# EAGLE design Butia Eagle v8 (EAGLE 5.09)
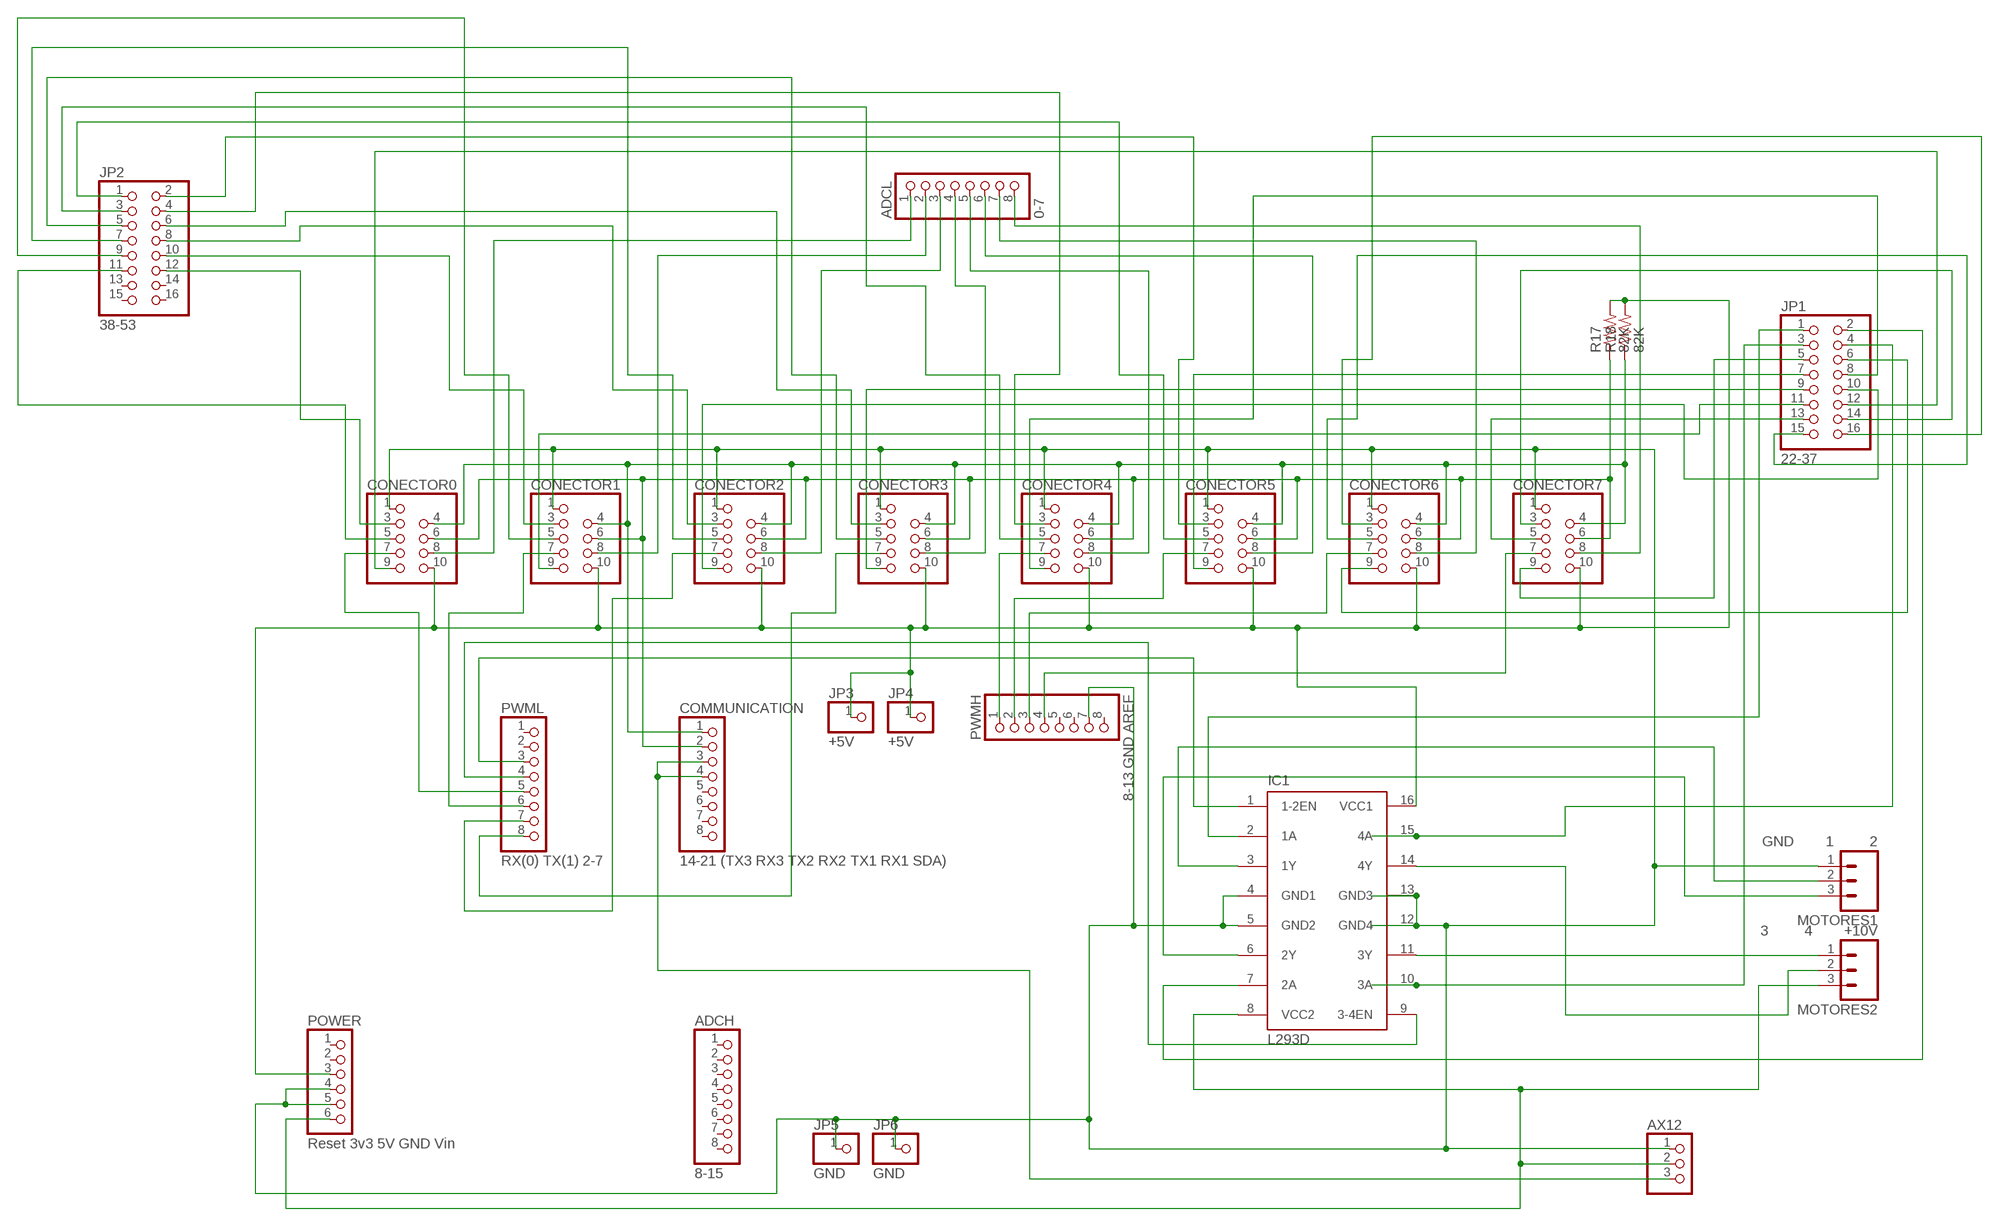
[diagram p0: schematic, sheet 1]

## Parts
ADCH  8-15  PINHD-1X8  [1X08]
ADCL  0-7  PINHD-1X8  [1X08]
AX12  AX12  [AX12]
COMMUNICATION  14-21 (TX3 RX3 TX2 RX2 TX1 RX1 SDA)  PINHD-1X8  [1X08]
CONECTOR0  9PIN  [9PIN]
CONECTOR1  9PIN  [9PIN]
CONECTOR2  9PIN  [9PIN]
CONECTOR3  9PIN  [9PIN]
CONECTOR4  9PIN  [9PIN]
CONECTOR5  9PIN  [9PIN]
CONECTOR6  9PIN  [9PIN]
CONECTOR7  9PIN  [9PIN]
IC1  L293D  [DIL16]
JP1  22-37  PINHD-2X8  [2X08]
JP2  38-53  PINHD-2X8  [2X08]
JP3  +5V  PINHD-1X1  [1X01]
JP4  +5V  PINHD-1X1  [1X01]
JP5  GND  PINHD-1X1  [1X01]
JP6  GND  PINHD-1X1  [1X01]
MOTORES1  GND 1 2  M03SCREW_LOCK  [SCREWTERMINAL-3.5MM-3_LOCK.007S]
MOTORES2  3 4 +10V  M03SCREW_LOCK  [SCREWTERMINAL-3.5MM-3_LOCK.007S]
POWER  Reset 3v3 5V GND Vin  PINHD-1X6  [1X06]
PWMH  8-13 GND AREF  PINHD-1X8  [1X08]
PWML  RX(0) TX(1) 2-7  PINHD-1X8  [1X08]
R17  82K  R-US_0207/7  [0207/7]
R18  82K  R-US_0207/7  [0207/7]

## Nets
+10V [power]: AX12.2 IC1.8(VCC2) MOTORES2.3 POWER.6
MASA [gnd]: AX12.1 CONECTOR0.1 CONECTOR1.1 CONECTOR2.1 CONECTOR3.1 CONECTOR4.1 CONECTOR5.1 CONECTOR6.1 CONECTOR7.1 IC1.4(GND1) IC1.5(GND2) IC1.12(GND4) IC1.13(GND3) JP5.1 JP6.1 MOTORES1.1 POWER.4 POWER.5 PWMH.7
N$1: CONECTOR0.5 JP2.11
N$2: CONECTOR0.3 JP2.12
N$3: CONECTOR1.5 JP2.9
N$4: CONECTOR1.3 JP2.10
N$5: CONECTOR2.5 JP2.7
N$6: CONECTOR2.3 JP2.8
N$8: CONECTOR3.5 JP2.5
N$9: CONECTOR3.3 JP2.6
N$10: CONECTOR4.3 JP2.4
N$11: CONECTOR4.5 JP2.3
N$13: CONECTOR5.3 JP2.2
N$15: CONECTOR6.3 JP1.16
N$16: CONECTOR7.5 JP1.13
N$17: CONECTOR7.3 JP1.14
N$18: ADCL.1 CONECTOR0.8
N$19 [polenta]: IC1.14(4Y) MOTORES2.2
N$20 [polenta]: IC1.11(3Y) MOTORES2.1
N$21 [polenta]: IC1.6(2Y) MOTORES1.3
N$22 [polenta]: IC1.3(1Y) MOTORES1.2
N$23: ADCL.2 CONECTOR1.8
N$24: ADCL.3 CONECTOR2.8
N$25: ADCL.4 CONECTOR3.8
N$26: ADCL.5 CONECTOR4.8
N$27: ADCL.6 CONECTOR5.8
N$28: ADCL.7 CONECTOR6.8
N$29: ADCL.8 CONECTOR7.8
N$30: AX12.3 COMMUNICATION.3 COMMUNICATION.4
N$31: IC1.1(1-2EN) PWML.3
N$32: IC1.9(3-4EN) PWML.4
N$33: CONECTOR0.7 PWML.5
N$34: CONECTOR1.7 PWML.6
N$35: CONECTOR2.7 PWML.7
N$36: CONECTOR3.7 PWML.8
N$37: CONECTOR4.7 PWMH.1
N$38: CONECTOR5.7 PWMH.2
N$39: CONECTOR6.7 PWMH.3
N$40: CONECTOR7.7 PWMH.4
N$41: IC1.2(1A) JP1.1
N$42: IC1.7(2A) JP1.2
N$43: IC1.10(3A) JP1.3
N$44: IC1.15(4A) JP1.4
N$45: CONECTOR7.9 JP1.5
N$46: CONECTOR6.9 JP1.6
N$47: CONECTOR5.9 JP1.7
N$48: CONECTOR4.9 JP1.8
N$49: CONECTOR3.9 JP1.9
N$50: CONECTOR2.9 JP1.10
N$51: CONECTOR1.9 JP1.11
N$52: CONECTOR0.9 JP1.12
N$53: CONECTOR5.5 JP2.1
N$54: CONECTOR6.5 JP1.15
POSITIVO [power]: CONECTOR0.10 CONECTOR1.10 CONECTOR2.10 CONECTOR3.10 CONECTOR4.10 CONECTOR5.10 CONECTOR6.10 CONECTOR7.10 IC1.16(VCC1) JP3.1 JP4.1 POWER.3 R17.2 R18.2
SCL: COMMUNICATION.1 CONECTOR0.4 CONECTOR1.4 CONECTOR2.4 CONECTOR3.4 CONECTOR4.4 CONECTOR5.4 CONECTOR6.4 CONECTOR7.4 R18.1
SDA: COMMUNICATION.2 CONECTOR0.6 CONECTOR1.6 CONECTOR2.6 CONECTOR3.6 CONECTOR4.6 CONECTOR5.6 CONECTOR6.6 CONECTOR7.6 R17.1
Unconnected: ADCH.1 ADCH.2 ADCH.3 ADCH.4 ADCH.5 ADCH.6 ADCH.7 ADCH.8 COMMUNICATION.5 COMMUNICATION.6 COMMUNICATION.7 COMMUNICATION.8 JP2.13 JP2.14 JP2.15 JP2.16 POWER.1 POWER.2 PWMH.5 PWMH.6 PWMH.8 PWML.1 PWML.2

## Library data of the parts
ADCH ADCL COMMUNICATION PWMH PWML = pinhead:PINHD-1X8: PIN HEADER
AX12 = butia:AX12
CONECTOR0 CONECTOR1-CONECTOR7 = butia:9PIN
IC1 = st-microelectronics:L293D: PUSH-PULL 4 CHANNEL DRIVER
JP1 JP2 = pinhead:PINHD-2X8: PIN HEADER
JP3-JP6 = pinhead:PINHD-1X1: PIN HEADER
MOTORES1 MOTORES2 = SparkFun:M03: Header 3 Standard 3-pin 0.1" header. Use with straight break away headers (SKU : PRT-00116), right angle break away headers (PRT-00553), swiss pins (PRT-00743), machine pins (PRT-00117), and female headers (PRT-00115). Molex polarized connector foot print use with SKU : PRT-08232 with associated crimp pins and housings.
POWER = pinhead:PINHD-1X6: PIN HEADER
R17 R18 = resistor:R-US_: RESISTOR, American symbol

## Net classes
0 default: width 0.254 mm, drill 0.457 mm, clearance 0.203 mm
1 power: width 0.508 mm, drill 0.711 mm, clearance 0.203 mm
2 gnd: width 0.406 mm, drill 0.61 mm, clearance 0.203 mm
3 polenta: width 0.356 mm, drill 0.508 mm, clearance 0.203 mm

## Board
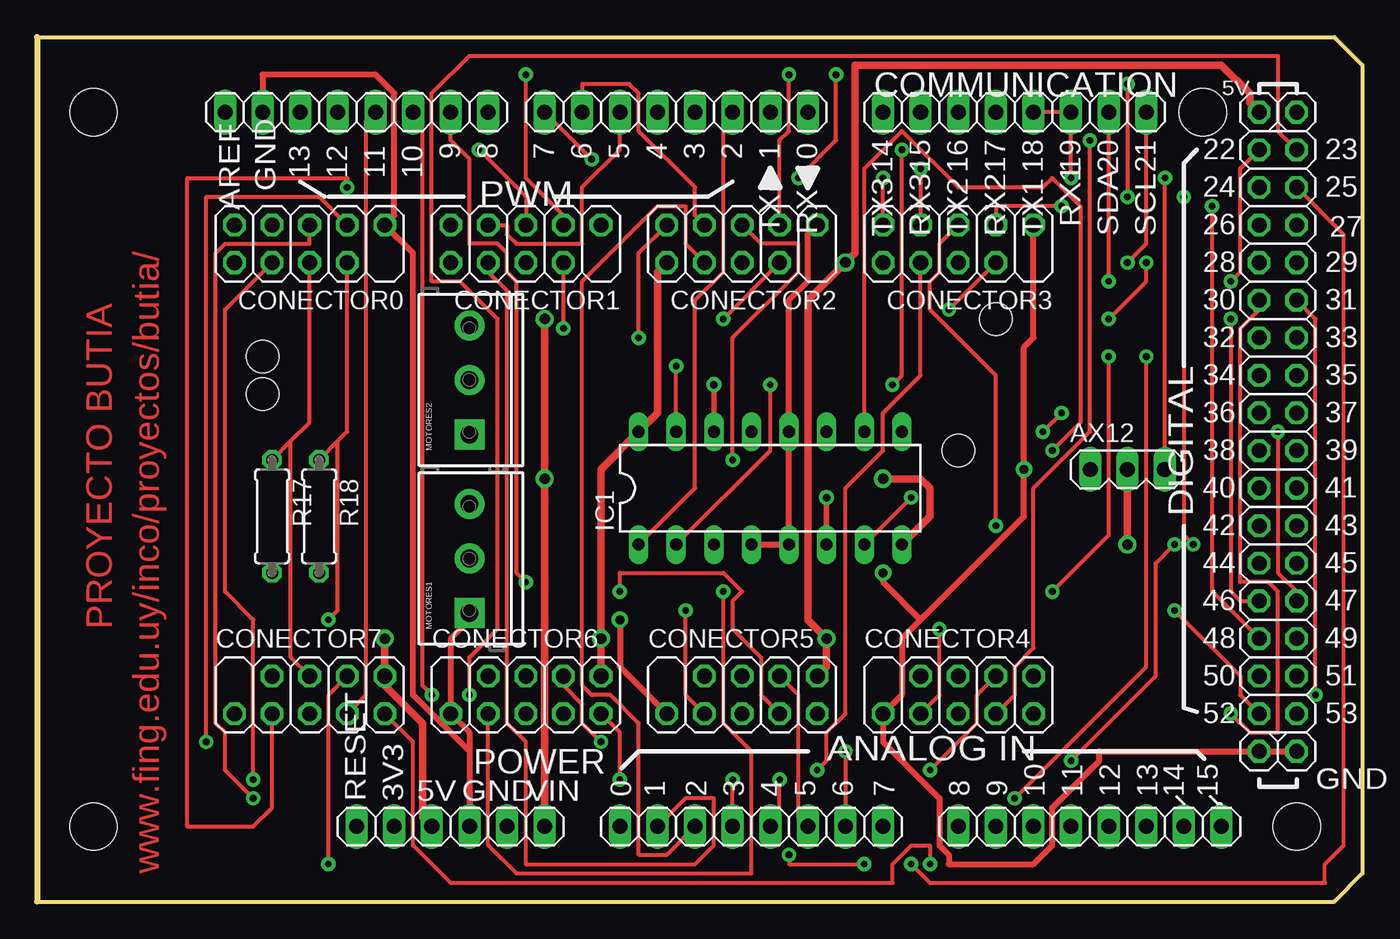
[diagram p1: board, top side]
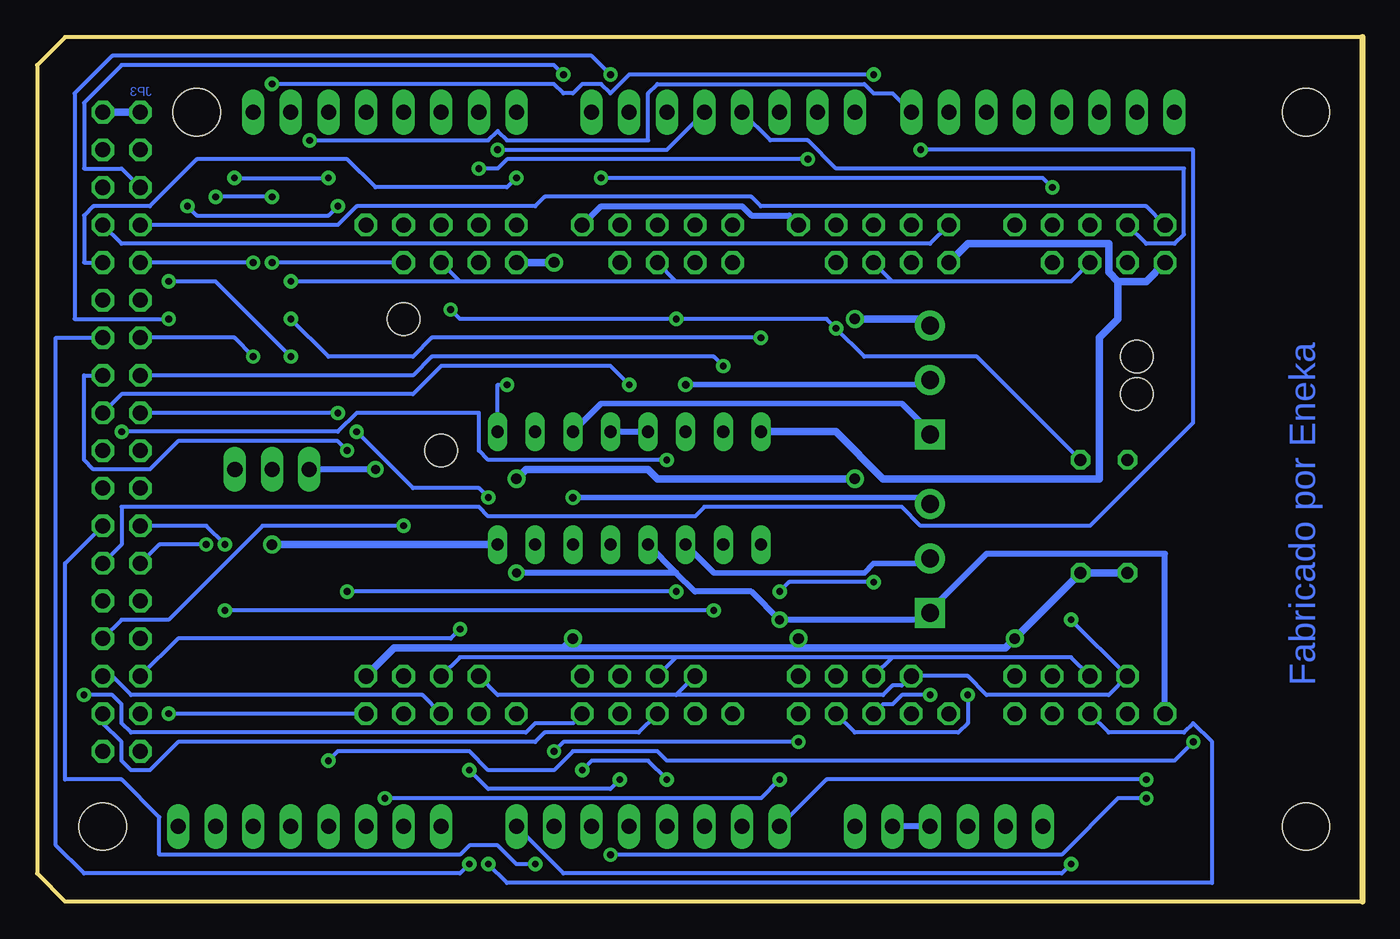
[diagram p2: board, bottom side, seen from below]

Size 89.53 x 58.42 mm. Coordinates in mm from the lower left corner, seen from the top.
Outline: 0,58.42 87.63,58.42 89.53,56.52 89.53,1.91 87.63,0 0,0 0,58.42
Copper layers (1*16): Top 0.035mm / dielectric 1.5mm / Bottom 0.035mm
Design rules "default *": minimum track width 8mil, minimum drill 16mil, track to track 8mil, track to pad 8mil, pad to pad 8mil, via to via 10mil, smd to smd 8mil, copper to edge 40mil, drill to drill 12mil, minimum pad ring 10mil, minimum via ring 10mil, stop-mask expansion 4mil, vias tented up to drill 0mil, thermal gap 10mil
Holes 3.2 mm at 85.09,5.08 3.81,53.34 78.74,53.34 3.81,5.08
Holes 2.2 mm at 64.77,39.37 15.24,36.83 15.24,34.29 62.23,30.48

### Footprints (pad centres in the part's own frame; a part is rotated, then mirrored left to right if it is on the bottom)
1X08 = drill 1.016 long: 1 -8.89,0; 2 -6.35,0; 3 -3.81,0; 4 -1.27,0; 5 1.27,0; 6 3.81,0; 7 6.35,0; 8 8.89,0
AX12 = drill 1.016 long: 1 -2.498,0; 2 0,0; 3 2.507,0.005
9PIN = drill 1.016 octagon: 1 -5.08,-1.27; 3 -2.54,-1.27; 4 -2.54,1.27; 5 0,-1.27; 6 0,1.27; 7 2.54,-1.27; 8 2.54,1.27; 9 5.08,-1.27; 10 5.08,1.27
DIL16 = drill 0.813 long: 1 -8.89,-3.81; 2 -6.35,-3.81; 3 -3.81,-3.81; 4 -1.27,-3.81; 5 1.27,-3.81; 6 3.81,-3.81; 7 6.35,-3.81; 8 8.89,-3.81; 9 8.89,3.81; 10 6.35,3.81; 11 3.81,3.81; 12 1.27,3.81; 13 -1.27,3.81; 14 -3.81,3.81; 15 -6.35,3.81; 16 -8.89,3.81
2X08 = drill 1.016 octagon: 1 -8.89,-1.27; 2 -8.89,1.27; 3 -6.35,-1.27; 4 -6.35,1.27; 5 -3.81,-1.27; 6 -3.81,1.27; 7 -1.27,-1.27; 8 -1.27,1.27; 9 1.27,-1.27; 10 1.27,1.27; 11 3.81,-1.27; 12 3.81,1.27; 13 6.35,-1.27; 14 6.35,1.27; 15 8.89,-1.27; 16 8.89,1.27
1X01 = drill 1.016 octagon: 1 0,0
SCREWTERMINAL-3.5MM-3_LOCK.007S = drill 1.2 pad 2.032 square: 1 -0.178,0 | drill 1.2 pad 2.032 round: 2 3.5,0; 3 7.178,0
1X06 = drill 1.016 long: 1 -6.35,0; 2 -3.81,0; 3 -1.27,0; 4 1.27,0; 5 3.81,0; 6 6.35,0
0207/7 = drill 0.813 octagon: 1 -3.81,0; 2 3.81,0

### Placement (x,y rotation side)
ADCH  71.12,5.08 0 top
ADCL  48.26,5.08 0 top
AX12  73.66,29.21 0 top
COMMUNICATION  66.04,53.34 180 top
CONECTOR0  18.41,44.45 180 top
CONECTOR1  33.02,44.45 180 top
CONECTOR2  47.62,44.45 180 top
CONECTOR3  62.23,44.45 180 top
CONECTOR4  62.23,13.97 0 top
CONECTOR5  47.62,13.97 0 top
CONECTOR6  33.02,13.97 0 top
CONECTOR7  18.41,13.97 0 top
IC1  49.53,27.94 0 top
JP1  83.82,41.91 90 top
JP2  83.82,21.59 90 top
JP3  82.55,53.34 0 top
JP4  85.09,53.34 0 top
JP5  82.55,10.16 0 top
JP6  85.09,10.16 0 top
MOTORES1  29.21,19.68 90 top
MOTORES2  29.21,31.75 90 top
POWER  27.94,5.08 0 top
PWMH  21.59,53.34 180 top
PWML  43.18,53.34 180 top
R17  15.88,26.04 270 top
R18  19.05,26.04 270 top

### Tracks (layer width: path | path; a pad name or v marks a point on that pad's centre or on a via)
+10V  (via drill 0.71)
  Top 0.508: v73.66,24.13 AX12.2 | v34.29,39.37 v34.29,28.57 POWER.6 | IC1.8 60.32,26.04 60.32,27.94 59.69,28.57 v57.15,28.57
  Bottom 0.508: IC1.8 v73.66,24.13 | v34.29,39.37 29.21,39.37 MOTORES2.3 | v57.15,28.57 56.51,29.21 48.26,29.21 47.62,28.57 v34.29,28.57
MASA  (via drill 0.61)
  Top 0.406: JP6.1 JP5.1 71.75,10.16 71.75,9.53 68.58,6.35 68.58,3.81 67.31,2.54 61.6,2.54 61.6,3.17 60.96,3.81 60.96,6.99 57.15,10.8 CONECTOR4.1 58.42,13.97 58.42,17.78 59.69,19.05 | 59.69,19.05 66.68,26.04 v66.68,29.21 66.68,37.46 67.31,38.1 CONECTOR3.1 | PWMH.7 15.24,55.88 22.86,55.88 24.13,54.61 24.13,46.35 CONECTOR0.1 25.4,43.81 25.4,13.97 29.21,10.16 | 29.21,10.16 POWER.4 | 29.21,10.16 29.21,11.43 CONECTOR6.1 27.94,17.78 29.21,19.05 MOTORES1.1 | IC1.4 IC1.5 IC1.12 50.8,40.64 52.07,41.91 52.07,45.09 CONECTOR2.1 | CONECTOR5.1 39.37,15.88 v39.37,19.05 | 59.69,19.05 57.15,21.59 v57.15,22.22
  Bottom 0.406: v66.68,29.21 AX12.1 | CONECTOR1.1 38.73,46.35 41.27,46.35 41.91,46.99 51.44,46.99 CONECTOR2.1 | POWER.4 POWER.5 | IC1.12 IC1.13 | CONECTOR7.1 13.34,23.49 25.4,23.49 29.21,19.68 MOTORES1.1 29.21,19.05 v39.37,19.05 41.27,20.95 45.09,20.95 46.35,22.22 | 46.35,22.22 IC1.4 | 46.35,22.22 v57.15,22.22
N$1  (via drill 0.46)
  Top 0.254: v55.88,2.54 50.8,2.54 v50.8,3.17 | v14.61,6.99 12.7,8.89 12.7,11.43 12.07,12.07 12.07,43.81 12.7,44.45 18.41,44.45 CONECTOR0.5
  Bottom 0.254: JP2.11 87.63,22.86 87.63,8.25 83.82,8.25 81.28,5.71 81.28,3.17 60.96,3.17 60.32,3.81 58.42,3.81 57.15,2.54 v55.88,2.54 | v50.8,3.17 20.32,3.17 16.51,6.99 v14.61,6.99
N$2  (via drill 0.46)
  Top 0.254: CONECTOR0.3 19.05,47.62 11.43,47.62 v11.43,10.8 | v69.85,9.53 75.56,15.24 75.56,22.86 v76.84,24.13
  Bottom 0.254: v11.43,10.8 12.7,9.53 46.99,9.53 47.62,10.16 53.34,10.16 54.61,8.89 59.05,8.89 60.32,10.16 69.22,10.16 v69.85,9.53 | v76.84,24.13 78.1,25.4 JP2.12
N$3  (via drill 0.46)
  Top 0.254: v29.84,50.8 33.02,47.62 CONECTOR1.5
  Bottom 0.254: JP2.9 83.82,24.13 83.82,26.67 59.69,26.67 59.05,26.04 45.09,26.04 44.45,26.67 31.12,26.67 29.84,25.4 18.41,25.4 11.43,32.38 11.43,50.8 v29.84,50.8
N$4  (via drill 0.46)
  Top 0.254: v78.1,24.13 77.47,24.77 v77.47,47.62 | v73.66,55.24 v73.66,47.62 | v33.02,55.88 33.02,48.89 35.56,46.35 CONECTOR1.3
  Bottom 0.254: JP2.10 81.28,24.13 v78.1,24.13 | v73.66,47.62 v77.47,47.62 | v73.66,55.24 54.61,55.24 53.98,54.61 53.34,54.61 52.71,55.24 51.44,55.24 50.8,54.61 49.53,55.88 v33.02,55.88
N$5  (via drill 0.46)
  Top 0.254: CONECTOR2.5 48.9,44.45 51.44,44.45 51.44,42.55 46.99,38.1 v46.99,29.84 | v83.82,31.75 83.82,22.22 85.09,20.95 JP2.7
  Bottom 0.254: v46.99,29.84 59.05,29.84 59.69,30.48 59.69,33.02 67.94,33.02 69.22,31.75 v83.82,31.75
N$6  (via drill 0.46)
  Top 0.254: CONECTOR2.3 50.16,51.44 50.8,52.07 v50.8,55.88 | v80.65,39.37 80.65,20.95 81.28,20.32 JP2.8
  Bottom 0.254: v50.8,55.88 52.07,57.15 84.46,57.15 87,54.61 87,39.37 v80.65,39.37
N$8  (via drill 0.46)
  Top 0.254: v64.77,25.4 64.77,35.56 60.32,40.01 60.32,41.91 60.96,42.55 60.96,44.45 CONECTOR3.5
  Bottom 0.254: JP2.5 83.82,19.05 80.65,19.05 74.29,25.4 v64.77,25.4
N$9  (via drill 0.46)
  Top 0.254: JP2.6 79.38,20.95 v79.38,46.99 | v69.22,46.99 64.77,46.99 CONECTOR3.3
  Bottom 0.254: v79.38,46.99 78.74,46.35 69.85,46.35 v69.22,46.99
N$10  (via drill 0.46)
  Top 0.254: CONECTOR4.3 60.96,13.97 v60.96,18.41
  Bottom 0.254: v60.96,18.41 61.6,17.78 80.01,17.78 JP2.4
N$11
  Bottom 0.254: CONECTOR4.5 63.5,13.97 83.19,13.97 84.46,15.24 JP2.3
N$13  (via drill 0.46)
  Top 0.254: CONECTOR5.3 43.81,13.97 v43.81,19.68 | v76.84,19.68 81.28,15.24 81.28,13.97 JP2.2
  Bottom 0.254: v43.81,19.68 v76.84,19.68
N$15  (via drill 0.46)
  Top 0.254: CONECTOR6.3 30.48,3.81 32.38,1.91 48.26,1.91 48.26,10.16 46.35,12.07 v46.35,20.95 | v68.58,20.95 72.39,24.77 v72.39,36.83 | v80.65,41.91 81.28,42.55 81.28,49.53 JP1.16
  Bottom 0.254: v46.35,20.95 v68.58,20.95 | v72.39,36.83 77.47,41.91 v80.65,41.91
N$16  (via drill 0.46)
  Top 0.254: v59.05,2.54 60.32,1.27 87,1.27 87,2.54 88.26,3.81 88.26,45.09 JP1.13
  Bottom 0.254: CONECTOR7.5 17.14,11.43 12.07,11.43 11.43,12.07 10.16,10.8 10.16,1.27 57.79,1.27 v59.05,2.54
N$17  (via drill 0.46)
  Top 0.254: CONECTOR7.3 15.88,6.35 14.61,5.08 10.16,5.08 10.16,48.89 20.95,48.89 v20.95,48.26 | v51.44,48.89 53.98,51.44 v53.98,55.88
  Bottom 0.254: v20.95,48.26 21.59,48.89 v51.44,48.89 | v53.98,55.88 54.61,56.52 83.82,56.52 86.36,53.98 86.36,49.53 83.82,49.53 JP1.14
N$18  (via drill 0.46)
  Top 0.254: v14.61,8.25 14.61,19.05 12.7,20.95 12.7,40.01 CONECTOR0.8
  Bottom 0.254: ADCL.1 36.2,8.25 v14.61,8.25
N$19  (via drill 0.51)
  Top 0.356: v45.72,34.92 IC1.14
  Bottom 0.356: v45.72,34.92 29.21,34.92 MOTORES2.2
N$20
  Bottom 0.356: IC1.11 51.44,33.66 31.12,33.66 29.21,31.75 MOTORES2.1
N$21  (via drill 0.51)
  Top 0.356: v53.34,27.3 IC1.6
  Bottom 0.356: v53.34,27.3 29.21,27.3 MOTORES1.3
N$22
  Bottom 0.356: IC1.3 43.81,22.22 33.66,22.22 33.02,22.86 29.21,22.86 MOTORES1.2
N$23
  Top 0.254: ADCL.2 43.81,6.99 45.72,6.99 45.72,3.81 44.45,2.54 33.02,2.54 33.02,10.8 31.75,12.07 31.75,41.27 30.48,42.55 CONECTOR1.8
N$24
  Top 0.254: ADCL.3 42.55,3.17 40.64,3.17 40.64,12.07 38.73,13.97 37.47,13.97 36.83,14.61 36.83,41.91 41.91,46.99 43.81,46.99 43.81,44.45 CONECTOR2.8
N$25  (via drill 0.46)
  Top 0.254: ADCL.4 v46.99,8.25 | v52.71,8.89 53.34,9.53 53.34,11.43 54.61,12.7 54.61,27.94 57.15,30.48 57.15,33.02 59.69,35.56 CONECTOR3.8
  Bottom 0.254: v46.99,8.25 48.26,9.53 52.07,9.53 v52.71,8.89
N$26  (via drill 0.46)
  Top 0.254: ADCL.5 50.16,5.71 v50.16,8.25 | v60.32,8.89 63.5,12.07 63.5,13.97 CONECTOR4.8
  Bottom 0.254: v50.16,8.25 50.8,7.62 59.05,7.62 v60.32,8.89
N$27
  Top 0.254: CONECTOR5.8 51.44,13.97 51.44,5.71 ADCL.6
N$28  (via drill 0.46)
  Top 0.254: v54.61,10.16 ADCL.7 | v38.1,10.8 36.83,12.07 36.83,13.34 35.56,14.61 CONECTOR6.8
  Bottom 0.254: v54.61,10.16 53.98,10.8 v38.1,10.8
N$29  (via drill 0.46)
  Top 0.254: CONECTOR7.8 19.68,13.97 v19.68,2.54
  Bottom 0.254: v19.68,2.54 20.32,1.91 53.98,1.91 ADCL.8
N$30  (via drill 0.46)
  Top 0.254: COMMUNICATION.4 COMMUNICATION.3 v69.85,48.89 | v76.2,48.89 76.2,29.84 AX12.3
  Bottom 0.254: v76.2,48.89 v69.85,48.89
N$31
  Top 0.254: IC1.1 44.45,27.94 44.45,40.64 46.35,42.55 46.35,52.7 PWML.3
N$32  (via drill 0.46)
  Top 0.254: v57.79,34.92 58.42,35.56 v58.42,50.8
  Bottom 0.254: IC1.9 58.42,34.92 v57.79,34.92 | v58.42,50.8 46.99,50.8 PWML.4
N$33
  Bottom 0.254: CONECTOR0.7 14.61,44.45 12.7,44.45 12.07,45.09 12.07,49.53 35.56,49.53 37.47,51.44 40.01,51.44 PWML.5
N$34
  Top 0.254: CONECTOR1.7 31.75,45.72 31.75,45.09 32.38,44.45 36.83,44.45 36.83,48.26 39.37,50.8 PWML.6
N$35
  Top 0.254: CONECTOR2.7 44.45,46.35 44.45,48.26 40.64,52.07 40.64,54.61 40.01,55.24 36.83,55.24 PWML.7
N$36  (via drill 0.46)
  Top 0.254: v37.47,50.16 PWML.8 | v59.69,49.53 CONECTOR3.7
  Bottom 0.254: v37.47,50.16 57.79,50.16 58.42,49.53 v59.69,49.53
N$37  (via drill 0.46)
  Top 0.254: v71.12,51.44 71.12,31.75 67.31,27.94 67.31,17.14 66.04,15.88 66.04,13.97 CONECTOR4.7
  Bottom 0.254: PWMH.1 31.75,54.61 33.02,54.61 33.66,55.24 47.62,55.24 48.26,54.61 48.26,51.44 57.79,51.44 58.42,52.07 59.05,51.44 v71.12,51.44
N$38  (via drill 0.46)
  Top 0.254: CONECTOR5.7 48.9,13.97 48.9,16.51 46.99,18.41 46.99,20.32 47.62,20.95 46.35,22.22 39.37,22.22 v39.37,20.95 | v33.02,21.59 32.38,22.22 32.38,41.91 31.75,42.55 31.75,43.81 31.12,44.45 29.21,44.45 29.21,50.16 27.94,51.44 PWMH.2
  Bottom 0.254: v39.37,20.95 38.73,21.59 v33.02,21.59
N$39  (via drill 0.46)
  Top 0.254: v26.67,13.97 26.04,14.61 26.04,52.7 PWMH.3
  Bottom 0.254: CONECTOR6.7 34.29,11.43 27.3,11.43 26.67,12.07 v26.67,13.97
N$40
  Top 0.254: CONECTOR7.7 22.23,13.97 22.23,52.7 PWMH.4
N$41  (via drill 0.46)
  Top 0.254: IC1.2 49.53,30.48 v49.53,34.92
  Bottom 0.254: v49.53,34.92 50.8,36.2 62.23,36.2 64.13,34.29 83.82,34.29 JP1.1
N$42  (via drill 0.46)
  Top 0.254: IC1.7 v59.05,27.3 | v67.94,31.75 v69.22,33.02
  Bottom 0.254: v59.05,27.3 59.69,27.94 64.13,27.94 v67.94,31.75 | v69.22,33.02 JP1.2
N$43  (via drill 0.46)
  Top 0.254: IC1.10 55.88,49.53 58.42,52.07 62.23,48.26 67.94,48.26 68.58,48.89 70.49,46.99 70.49,32.38 v68.58,30.48
  Bottom 0.254: v68.58,30.48 69.22,31.11 80.01,31.11 81.91,29.21 85.72,29.21 86.36,29.84 86.36,35.56 JP1.3
N$44  (via drill 0.46)
  Top 0.254: IC1.15 v43.18,36.2
  Bottom 0.254: v43.18,36.2 43.81,36.83 62.87,36.83 64.13,35.56 JP1.4
N$45  (via drill 0.46)
  Top 0.254: CONECTOR7.9 25.4,10.8 25.4,3.81 27.94,1.27 57.79,1.27 57.79,2.54 59.05,3.81 60.32,3.81 v60.32,2.54
  Bottom 0.254: v60.32,2.54 60.96,1.91 86.36,1.91 88.26,3.81 88.26,38.1 JP1.5
N$46  (via drill 0.46)
  Top 0.254: CONECTOR6.9 39.37,11.43 v39.37,8.25 | v66.04,6.99 74.93,15.88 v74.93,36.83
  Bottom 0.254: v39.37,8.25 40.64,6.99 v66.04,6.99 | v74.93,36.83 76.2,38.1 JP1.6
N$47  (via drill 0.46)
  Top 0.254: v86.36,13.97 86.36,39.37 JP1.7
  Bottom 0.254: CONECTOR5.9 53.34,12.07 55.88,12.07 56.51,11.43 83.19,11.43 83.82,12.07 83.82,13.34 84.46,13.97 v86.36,13.97
N$48  (via drill 0.46)
  Top 0.254: v80.65,12.7 81.91,11.43 83.82,11.43 83.82,20.95 83.19,21.59 81.28,21.59 81.28,38.73 82.55,40.01 JP1.8
  Bottom 0.254: CONECTOR4.9 v80.65,12.7
N$49  (via drill 0.46)
  Top 0.254: CONECTOR3.9 v57.15,48.89
  Bottom 0.254: v57.15,48.89 57.79,48.26 66.68,48.26 68.58,50.16 78.74,50.16 81.91,46.99 85.72,46.99 86.36,46.35 86.36,43.18 JP1.9
N$50  (via drill 0.46)
  Top 0.254: CONECTOR2.9 40.64,43.81 v40.64,38.1 | v72.39,39.37 74.93,41.91 v74.93,43.18
  Bottom 0.254: v40.64,38.1 62.87,38.1 64.13,36.83 69.85,36.83 v72.39,39.37 | v74.93,43.18 JP1.10
N$51
  Bottom 0.254: CONECTOR1.9 29.21,44.45 83.82,44.45 JP1.11
N$52
  Bottom 0.254: CONECTOR0.9 14.61,46.99 40.64,46.99 41.27,47.62 55.24,47.62 55.88,46.99 67.94,46.99 69.22,45.72 JP1.12
N$53
  Bottom 0.254: CONECTOR5.5 48.9,11.43 55.24,11.43 55.88,10.8 80.01,10.8 81.91,8.89 83.19,8.89 83.82,9.53 83.82,10.8 85.09,12.07 JP2.1
N$54  (via drill 0.46)
  Top 0.254: v29.21,13.97 29.21,16.51 31.12,18.41 31.12,39.37 28.58,41.91 26.67,41.91 26.67,54.61 29.21,57.15 83.82,57.15 83.82,52.07 JP1.15
  Bottom 0.254: CONECTOR6.5 32.38,13.34 31.75,13.34 31.12,13.97 v29.21,13.97
POSITIVO  (via drill 0.71)
  Top 0.508: CONECTOR6.10 v38.1,17.78 38.1,29.21 IC1.16 41.91,33.02 41.91,42.55 CONECTOR2.10 | POWER.3 26.04,5.71 26.04,12.07 23.49,14.61 CONECTOR7.10 v23.49,17.78 | CONECTOR5.10 53.34,15.88 v53.34,17.78 52.07,19.05 52.07,40.64 v54.61,43.18 55.24,43.81 55.24,56.52 80.01,56.52 81.91,54.61 81.91,53.98 JP3.1
  Bottom 0.508: CONECTOR0.10 14.61,41.91 16.51,41.91 | 16.51,41.91 17.14,42.55 17.14,44.45 26.67,44.45 CONECTOR1.10 | 16.51,41.91 16.51,39.37 17.78,38.1 17.78,28.57 32.38,28.57 35.56,31.75 IC1.16 | JP3.1 JP4.1 | R17.2 R18.2 v23.49,17.78 24.13,17.14 38.1,17.14 | 53.98,17.14 v53.34,17.78 | 53.98,17.14 65.41,17.14 CONECTOR4.10 | v54.61,43.18 CONECTOR3.10 | 38.1,17.14 53.98,17.14 | 38.1,17.14 v38.1,17.78
SCL  (via drill 0.46)
  Top 0.254: v73.66,43.18 74.93,44.45 COMMUNICATION.1 | 20.32,31.11 20.95,31.75 CONECTOR0.4 | 20.32,31.11 R18.1 | v35.56,38.73 CONECTOR1.4 | v46.35,39.37 CONECTOR2.4 | v61.6,40.01 CONECTOR3.4 | v19.68,19.05 20.32,19.68 20.32,31.11
  Bottom 0.254: 46.35,13.97 CONECTOR5.4 | 46.35,13.97 58.42,13.97 CONECTOR4.4 | 46.35,13.97 32.38,13.97 31.75,14.61 31.12,14.61 CONECTOR6.4 26.67,15.24 25.4,13.97 17.14,13.97 CONECTOR7.4 v19.68,19.05 | CONECTOR3.4 v73.66,43.18 | R18.1 26.04,36.83 33.66,36.83 v35.56,38.73 36.2,39.37 v46.35,39.37 60.96,39.37 v61.6,40.01
SDA  (via drill 0.46)
  Top 0.254: 17.14,31.11 18.41,32.38 CONECTOR0.6 | 17.14,31.11 R17.1 | CONECTOR7.6 17.14,16.51 17.14,31.11 | v72.39,41.91 COMMUNICATION.2
  Bottom 0.254: 31.75,16.51 CONECTOR6.6 | 31.75,16.51 19.68,16.51 CONECTOR7.6 | 46.35,16.51 CONECTOR5.6 | 31.75,16.51 46.35,16.51 | CONECTOR4.6 60.96,16.51 46.35,16.51 | 31.75,41.91 CONECTOR1.6 | 31.75,41.91 19.68,41.91 CONECTOR0.6 | 46.35,41.91 CONECTOR2.6 | 31.75,41.91 46.35,41.91 | 60.96,41.91 CONECTOR3.6 | 46.35,41.91 60.96,41.91 | 60.96,41.91 v72.39,41.91

### Text on the board
Top: PROYECTO BUTIA | www.fing.edu.uy/inco/proyectos/butia/
Bottom: Fabricado por Eneka
tPlace: 9 | 8 | 7 | 6 | 5 | 4 | 3 | 2 | 1 | 0 | 22 | 23 | 14 | 15 | 16 | 17 | 18 | 19 | 20 | 21 | 13 | 12 | 11 | 10 | 24 | 25 | 27 | 26 | 28 | 29 | 30 | 31 | 32 | 33 | 34 | 35 | 36 | 37 | 38 | 39 | 40 | 41 | 42 | 43 | 44 | 45 | 46 | 47 | 48 | 49 | 50 | 51 | 52 | 53 | 0 | 1 | 2 | 3 | 4 | 5 | 6 | 7 | 8 | 9 | 10 | 11 | 12 | 13 | 14 | 15
tNames: 5V | GND | AREF | PWM | TX | RX | RX1 | TX3 | RX3 | TX2 | RX2 | TX1 | SDA | SCL | DIGITAL | ANALOG IN | GND | RESET | 3V3 | 5V | GND | VIN